# EAGLE design 2DD-17-mk-3.0.0 (EAGLE 6.6.0)
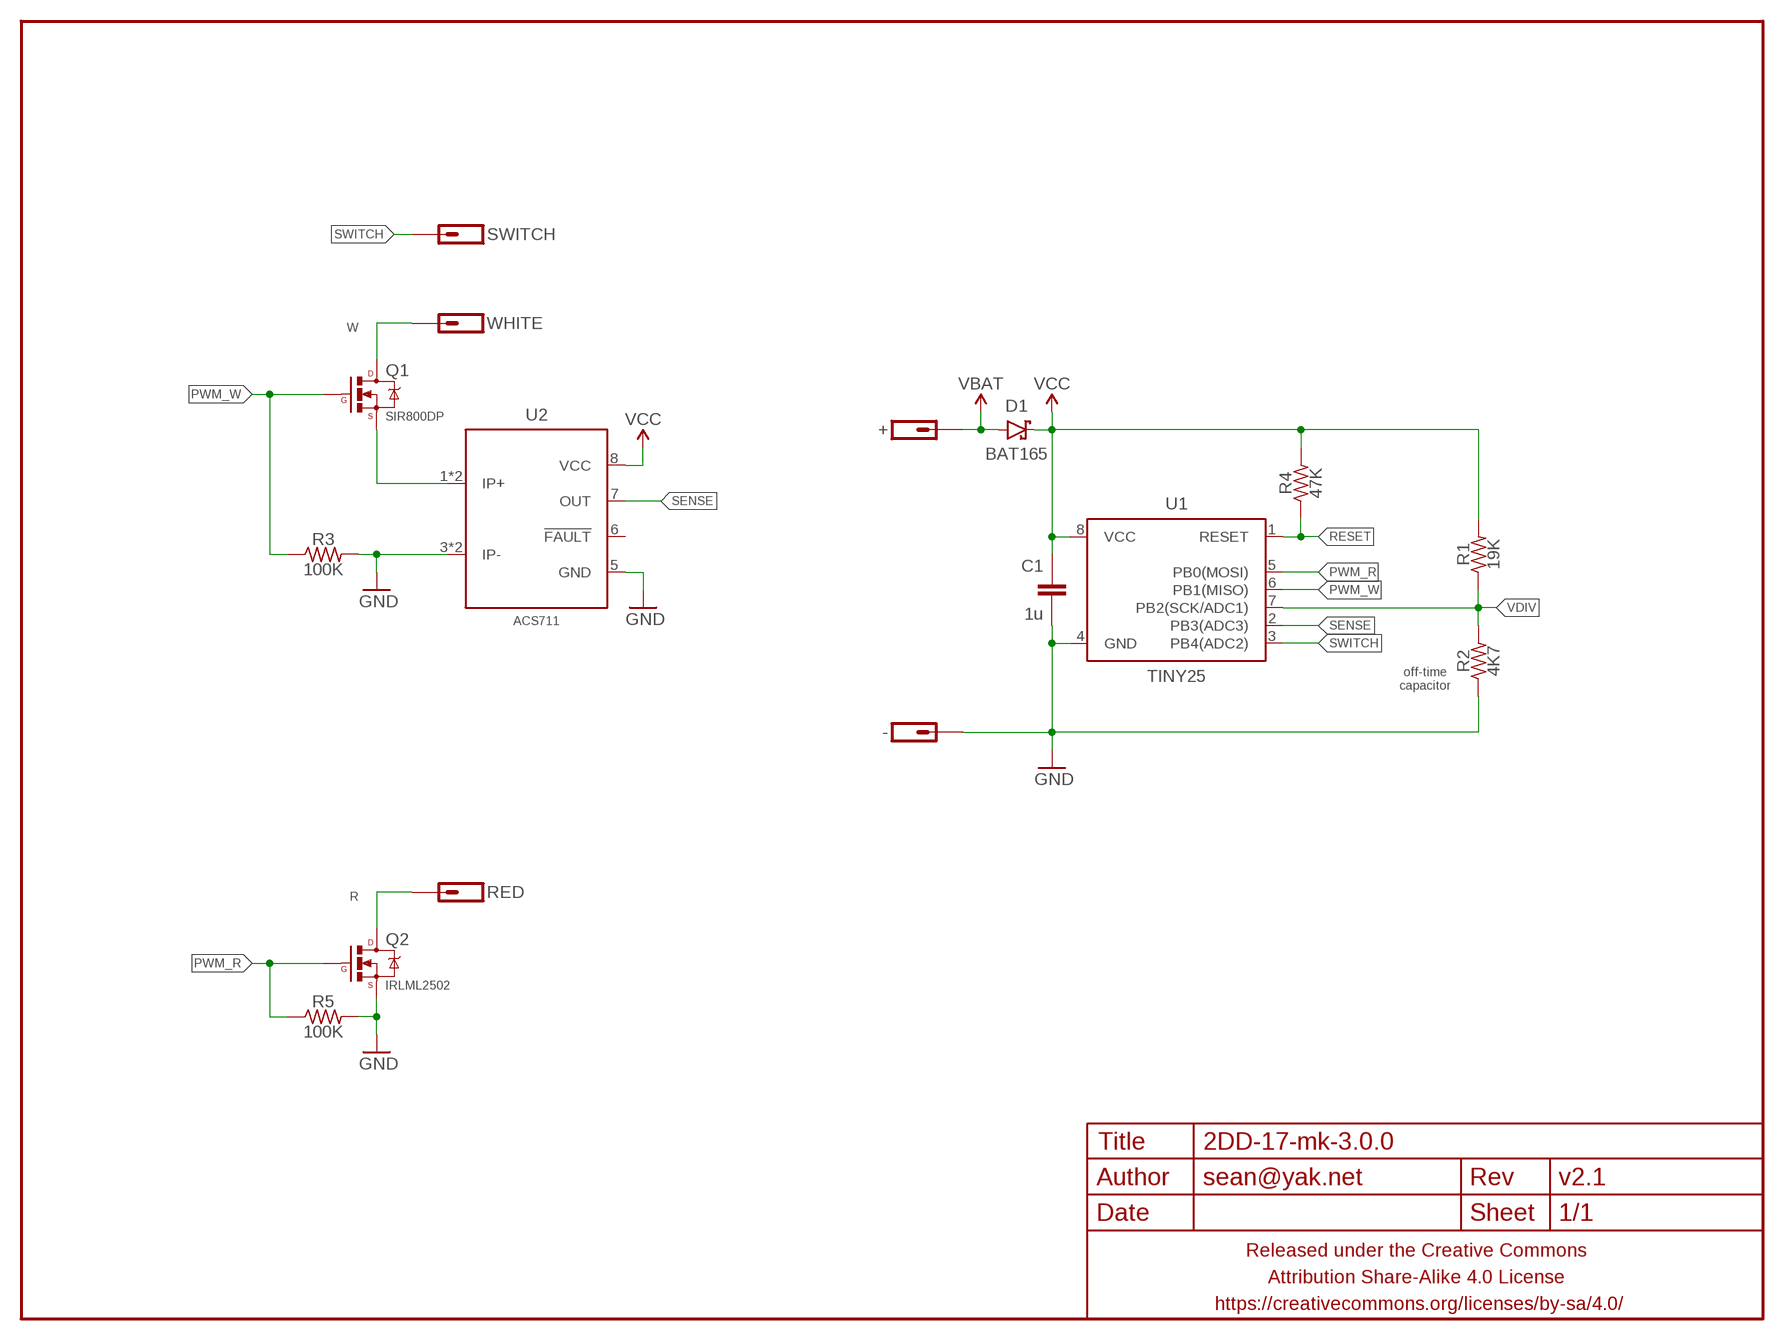
[diagram p0: schematic, sheet 1]

## Parts
+  M01PTH-1MM-CIR-NS  [1X01-1MM-CIR-NS]
-  M01NOT-A-VIA-NOPE  [1X01_NOSILK_NOSTOP]
C1  1u  CAPACITOR-CERAMICC0402  [C0402]
D1  BAT165  DIODE-SCHOTTKYSOD323  [SOD323-SCHOTTKY]
FRAME1  FRAME-LETTERNO_PACKAGE  [DUMMY]
Q1  SIR800DP  MOSFET-NCHANNELPSMN4R0-30YLD  [LFPAK56]
Q2  IRLML2502  MOSFET-NCHANNELIRLML2502  [SOT23]
R1  19K  RESISTORR0402  [R0402]
R2  4K7  RESISTORR0402  [R0402]
R3  100K  RESISTORR0402  [R0402]
R4  47K  RESISTORR0402  [R0402]
R5  100K  RESISTORR0402  [R0402]
RED  M01SMD-1.25MM-DIA  [1X01-SMD-1.25DIA]
SWITCH  M01SMD-1.25MM-DIA  [1X01-SMD-1.25DIA]
U1  TINY25  ATTINY45TINY25-SOICN-NARROWER  [SO08-SKINNYPADS]
U2  ACS711  ACS711LC  [SO08-SKINNYPADS]
WHITE  M01SMD-1.25MM-DIA  [1X01-SMD-1.25DIA]

## Nets
GND: -.P$1 C1.2 Q2.2(S) R2.1 R3.2 R5.2 U1.4(GND) U2.3(IP-) U2.4(IP-) U2.5(GND)
N$1: Q1.1(S) Q1.2(S) Q1.3(S) U2.1(IP+) U2.2(IP+)
PWM_R: Q2.1(G) R5.1 U1.5(PB0(MOSI))
PWM_W: Q1.4(G) R3.1 U1.6(PB1(MISO))
R: Q2.3(D) RED.P$1
RESET: R4.1 U1.1(RESET)
SENSE: U1.2(PB3(ADC3))
SWITCH: SWITCH.P$1 U1.3(PB4(ADC2))
VBAT: +.1 D1.A
VCC: C1.1 D1.C R1.2 R4.2 U1.8(VCC) U2.8(VCC)
VDIV: R1.1 R2.2 U1.7(PB2(SCK/ADC1))
W: Q1.PAD(D) WHITE.P$1
Unconnected: U2.6(!FAULT) U2.7(OUT)

## Notes on the sheet
- off-time
  capacitor

## Library data of the parts
+ - RED SWITCH WHITE = a_parts:M01: Header 1 Standard 1-pin 0.1" header. Use with straight break away headers (SKU : PRT-00116), right angle break away headers (PRT-00553), swiss pins (PRT-00743), machine pins (PRT-00117), and female headers (PRT-00115).
C1 = a_parts:CAPACITOR-CERAMIC: CAPACITOR, European symbol
D1 = a_parts:DIODE-SCHOTTKY: Schottky diodes in SFE's production catalog BAT20J 1A 23V 0.62Vf RB751 120mA 40V 0.37Vf PMEG4005EJ 0.5A 40V 0.42Vf MBRA140 1A 40V 0.5Vf B340A 3A 40V SMA
FRAME1 = a_parts:FRAME-LETTER: Schematic Frame Standard 8.5x11 US Letter frame; DESIGNER: sean@yak.net; VERSION: v2.1
Q1 Q2 = a_parts:MOSFET-NCHANNEL: Common NMOSFET Parts MFG P/N Store ID Prod ID FDD8780 TRANS-09984 SI7820DN TRANS-11055 FDS6630A IC-08089 2N7002PW TRANS-11151 FQP30N06L COM-10213 TRANS-10060 BSS123LT1G TRANS-08345 BSS138 TRANS-00830 BS170 2N7000
R1-R5 = a_parts:RESISTOR: RESISTOR, American symbol
U1 = a_parts:ATTINY45: Atmel 8-pin 2/4/8kB flash uC
U2 = a_parts:ACS711

## Board
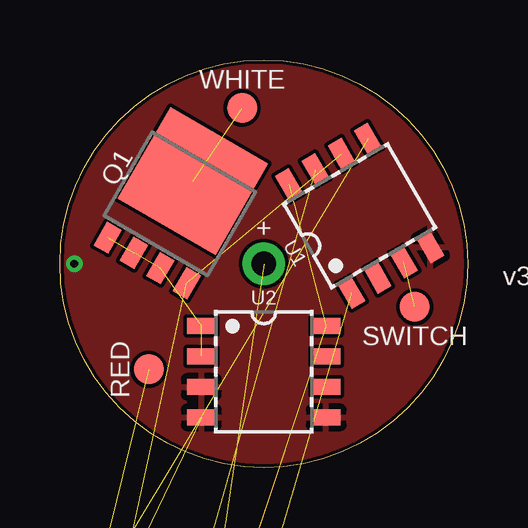
[diagram p1: board, top side]
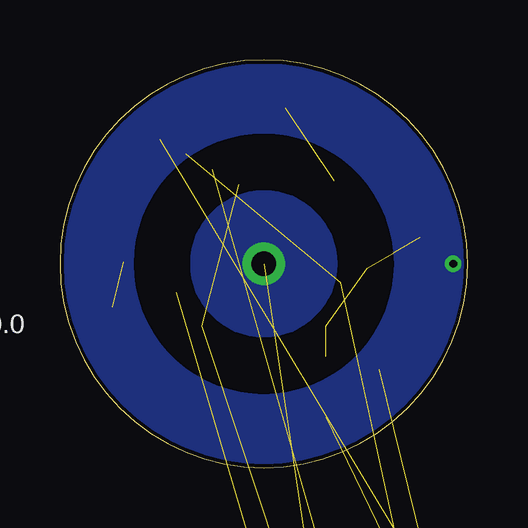
[diagram p2: board, bottom side, seen from below]

Size 17 x 17 mm. Coordinates in mm from the lower left corner, seen from the top.
Outline: 0,8.5 arc-180 17,8.5 arc-180 0,8.5
Copper layers (1*16): Top 0.0356mm / dielectric 1.5011mm / Bottom 0.0356mm
Design rules "LaenPCBOrder2 *": minimum track width 6mil, minimum drill 13mil, track to track 6mil, track to pad 6mil, pad to pad 6mil, via to via 6mil, smd to smd 6mil, copper to edge 6mil, drill to drill 6mil, minimum pad ring 7mil, minimum via ring 7mil, stop-mask expansion 3mil, vias tented up to drill 20mil, thermal gap 10mil

### Footprints (pad centres in the part's own frame; a part is rotated, then mirrored left to right if it is on the bottom)
1X01-1MM-CIR-NS = drill 1.016 pad 1.778: 1 0,0
1X01_NOSILK_NOSTOP = drill 0.33: P$1 0,0
C0402 = smd 0.6 x 0.7: 1 -0.5,0; 2 0.5,0
SOD323-SCHOTTKY = smd 0.8 x 0.6: A -1.25,0; C 1.25,0
LFPAK56 = smd 0.7 x 1.15: 1 -1.905,-2.725; 2 -0.635,-2.725; 3 0.635,-2.725; 4 1.905,-2.725 | smd 4.7 x 4.4: PAD 0,1.1
SOT23 = smd 1 x 1.2: 1 -0.95,-1; 2 0.95,-1; 3 0,1
R0402 = smd 0.6 x 0.7: 1 -0.5,0; 2 0.5,0
1X01-SMD-1.25DIA = smd 1.25 x 1.25: P$1 0,0
SO08-SKINNYPADS = smd 0.65 x 1.2: 1 -1.905,-2.6; 2 -0.635,-2.6; 3 0.635,-2.6; 4 1.905,-2.6; 5 1.905,2.6; 6 0.635,2.6; 7 -0.635,2.6; 8 -1.905,2.6

### Placement (x,y rotation side)
+  8.5,8.5 0 top
-  0.6,8.5 90 bottom
C1  1.5,-36.5 0 top  (outside the outline)
D1  2,-43.5 0 top  (outside the outline)
FRAME1  0,0 0 top
Q1  5,11 330 top
Q2  -7.5,-42.5 0 top  (outside the outline)
R1  1.5,-21.5 0 top  (outside the outline)
R2  1.5,-24.5 0 top  (outside the outline)
R3  1.5,-12 0 top  (outside the outline)
R4  1.5,-30.5 0 top  (outside the outline)
R5  1.5,-6 0 top  (outside the outline)
RED  3.7,4.1 90 top
SWITCH  14.8,6.7 180 top
U1  12.5,10.5 30 top
U2  8.5,4 270 top
WHITE  7.6,15 0 top

### Tracks (layer width: path | path; a pad name or v marks a point on that pad's centre or on a via)
GND  (5 unrouted)
  pour Bottom (isolate 0.152, rank 6, no thermals): 0,8.5 3,8.5 arc90 8.5,3 arc90 14,8.5 17,8.5 arc-90 8.5,0 arc-90
  pour Top (isolate 0.152, rank 6): 17,0 17,17 0,17 0,0
  pour Bottom (isolate 0.152, rank 6, no thermals): 17,8.5 14,8.5 arc90 8.5,14 arc90 3,8.5 0,8.5 arc-90 8.5,17 arc-90
N$1  (4 unrouted)
PWM_R  (2 unrouted)
PWM_W  (2 unrouted)
R  (1 unrouted)
RESET  (1 unrouted)
SWITCH  (1 unrouted)
VBAT  (1 unrouted)
  pour Bottom (isolate 0.152, no thermals): 5.5,8.5 arc-180 11.5,8.5 arc-180
VCC  (5 unrouted)
VDIV  (2 unrouted)
W  (1 unrouted)

### Text on the board
tNames: GND